# EAGLE design Mainboard (EAGLE 9.3.2)
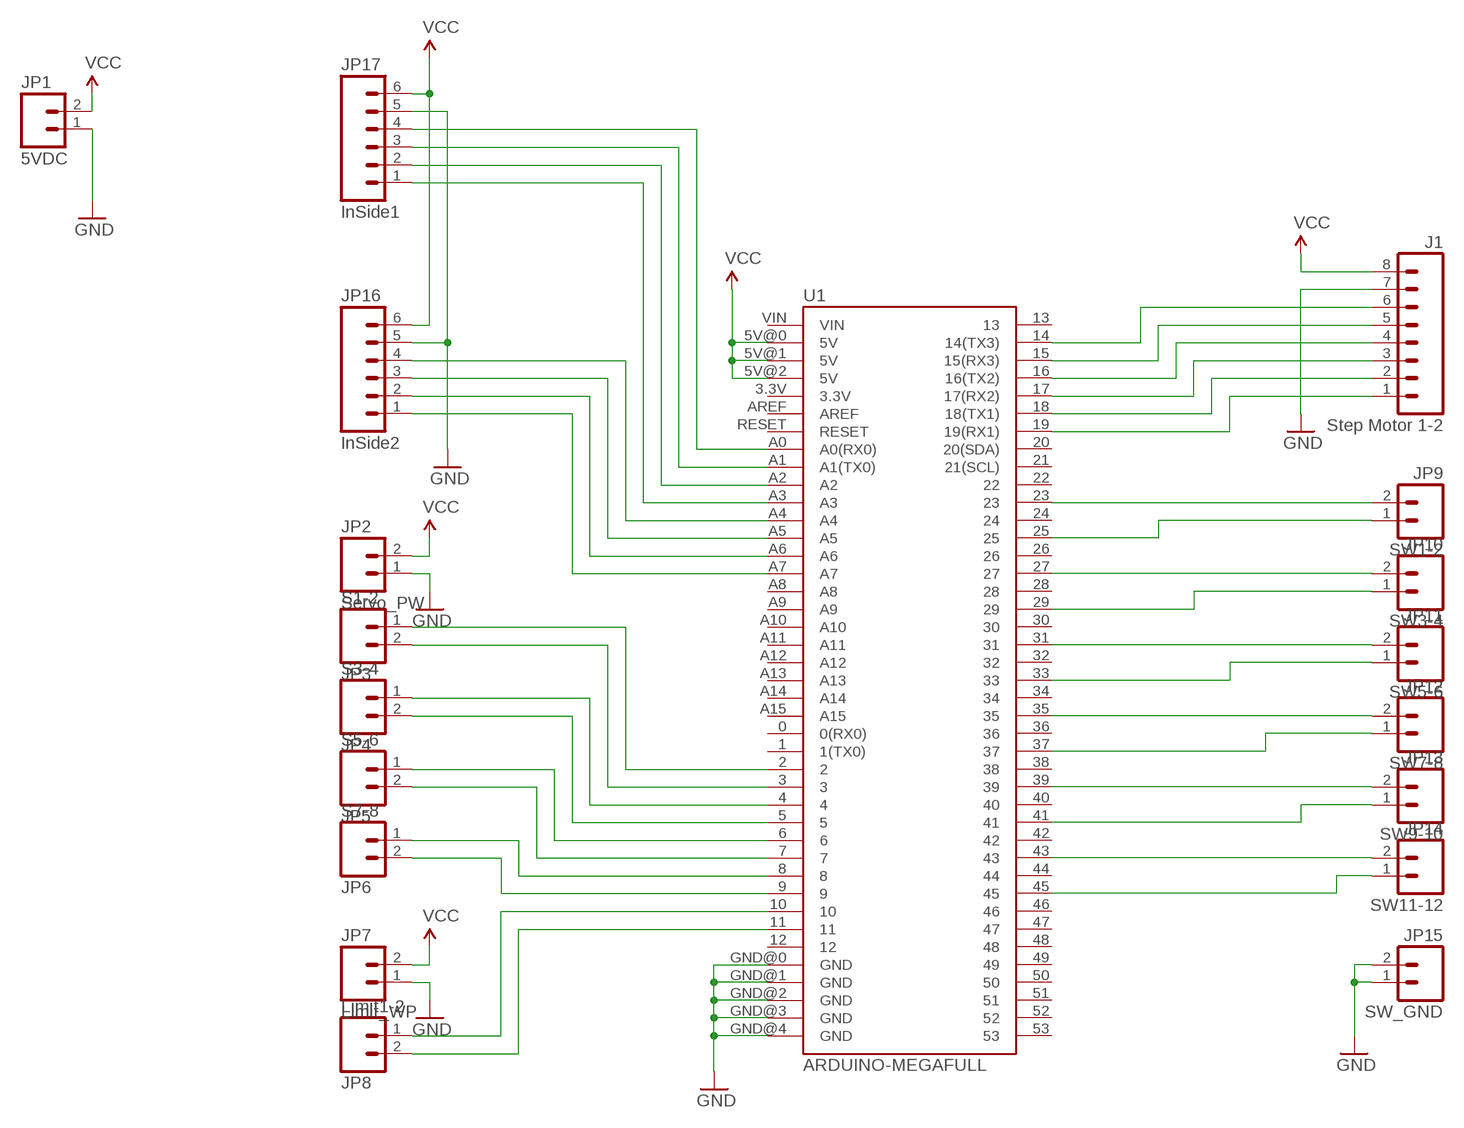
[diagram p0: schematic, sheet 1]

## Parts
J1  Step Motor 1-2  M08LONGPADS  [1X08_LONGPADS]
JP1  5VDC  M025MM  [SCREWTERMINAL-5MM-2]
JP2  Servo_PW  M025MM  [SCREWTERMINAL-5MM-2]
JP3  S1-2  M025MM  [SCREWTERMINAL-5MM-2]
JP4  S3-4  M025MM  [SCREWTERMINAL-5MM-2]
JP5  S5-6  M025MM  [SCREWTERMINAL-5MM-2]
JP6  S7-8  M025MM  [SCREWTERMINAL-5MM-2]
JP7  Limit_WP  M025MM  [SCREWTERMINAL-5MM-2]
JP8  Limit1-2  M025MM  [SCREWTERMINAL-5MM-2]
JP9  SW1-2  M025MM  [SCREWTERMINAL-5MM-2]
JP10  SW3-4  M025MM  [SCREWTERMINAL-5MM-2]
JP11  SW5-6  M025MM  [SCREWTERMINAL-5MM-2]
JP12  SW7-8  M025MM  [SCREWTERMINAL-5MM-2]
JP13  SW9-10  M025MM  [SCREWTERMINAL-5MM-2]
JP14  SW11-12  M025MM  [SCREWTERMINAL-5MM-2]
JP15  SW_GND  M025MM  [SCREWTERMINAL-5MM-2]
JP16  InSide2  M06LONGPADS  [1X06_LONGPADS]
JP17  InSide1  M06LONGPADS  [1X06_LONGPADS]
U1  ARDUINO-MEGAFULL  [ARDUINO_MEGA]

## Nets
GND: J1.7 JP1.1 JP2.1 JP7.1 JP15.1 JP15.2 JP16.5 JP17.5 U1.GND@0(GND) U1.GND@1(GND) U1.GND@2(GND) U1.GND@3(GND) U1.GND@4(GND)
N$3: JP3.1 U1.2
N$4: JP3.2 U1.3
N$5: JP4.1 U1.4
N$6: JP4.2 U1.5
N$7: JP5.1 U1.6
N$8: JP5.2 U1.7
N$9: JP6.1 U1.8
N$10: JP6.2 U1.9
N$11: JP8.1 U1.10
N$12: JP8.2 U1.11
N$13: JP9.2 U1.23
N$14: JP9.1 U1.25
N$15: JP10.2 U1.27
N$16: JP10.1 U1.29
N$17: JP11.2 U1.31
N$18: JP11.1 U1.33
N$19: JP12.2 U1.35
N$20: JP12.1 U1.37
N$21: JP13.2 U1.39
N$22: JP13.1 U1.41
N$23: JP14.2 U1.43
N$24: JP14.1 U1.45
N$25: JP17.4 U1.A0(A0(RX0))
N$26: JP17.3 U1.A1(A1(TX0))
N$27: JP17.2 U1.A2
N$28: JP17.1 U1.A3
N$29: JP16.4 U1.A4
N$30: JP16.3 U1.A5
N$31: JP16.2 U1.A6
N$32: JP16.1 U1.A7
N$33: J1.1 U1.19(19(RX1))
N$34: J1.2 U1.18(18(TX1))
N$35: J1.3 U1.17(17(RX2))
N$36: J1.4 U1.16(16(TX2))
N$37: J1.5 U1.15(15(RX3))
N$38: J1.6 U1.14(14(TX3))
VCC: J1.8 JP1.2 JP2.2 JP7.2 JP16.6 JP17.6 U1.5V@0(5V) U1.5V@1(5V) U1.5V@2(5V)
Unconnected: U1.0(0(RX0)) U1.1(1(TX0)) U1.3.3V U1.12 U1.13 U1.20(20(SDA)) U1.21(21(SCL)) U1.22 U1.24 U1.26 U1.28 U1.30 U1.32 U1.34 U1.36 U1.38 U1.40 U1.42 U1.44 U1.46 U1.47 U1.48 U1.49 U1.50 U1.51 U1.52 U1.53 U1.A8 U1.A9 U1.A10 U1.A11 U1.A12 U1.A13 U1.A14 U1.A15 U1.AREF U1.RESET U1.VIN

## Library data of the parts
J1 = SparkFun-Connectors:M08: Header 8 Standard 8-pin 0.1" header. Use with straight break away headers (SKU : PRT-00116), right angle break away headers (PRT-00553), swiss pins (PRT-00743), machine pins (PRT-00117), and female headers (PRT-00115).
JP1-JP15 = SparkFun:M02: Header 2 Standard 2-pin 0.1" header. Use with straight break away headers (SKU : PRT-00116), right angle break away headers (PRT-00553), swiss pins (PRT-00743), machine pins (PRT-00117), and female headers (PRT-00115). Molex polarized connector foot print use with SKU : PRT-08233 with associated crimp pins and housings.
JP16 JP17 = SparkFun:M06: Header 6 Standard 6-pin 0.1" header. Use with straight break away headers (SKU : PRT-00116), right angle break away headers (PRT-00553), swiss pins (PRT-00743), machine pins (PRT-00117), and female headers (PRT-00115). Molex polarized connector foot print use with SKU : PRT-08094 with associated crimp pins and housings. NOTES ON THE VARIANTS LOCK and LOCK_LONGPADS... This footprint was designed to help hold the alignment of a through-hole component (i.e. 6-pin header) while soldering it into place. You may notice that each hole has been shifted either up or down by 0.005 of an inch from it's more standard position (which is a perfectly straight line). This slight alteration caused the pins (the squares in the middle) to touch the edges of the holes. Because they are alternating, it causes a "brace" to hold the component in place. 0.005 has proven to be the perfect amount of "off-center" position when using our standard breakaway headers. Although looks a little odd when you look at the bare footprint, once you have a header in there, the alteration is very hard to notice. Also, if you push a header all the way into place, it is covered up entirely on the bottom side. This idea of altering the position of holes to aid alignment will be further integrated into the Sparkfun Library for other footprints. It can help hold any component with 3 or more connection pins.
U1 = SparkFun-Boards:ARDUINO-MEGA: Arduino Mega board footprint

## Board
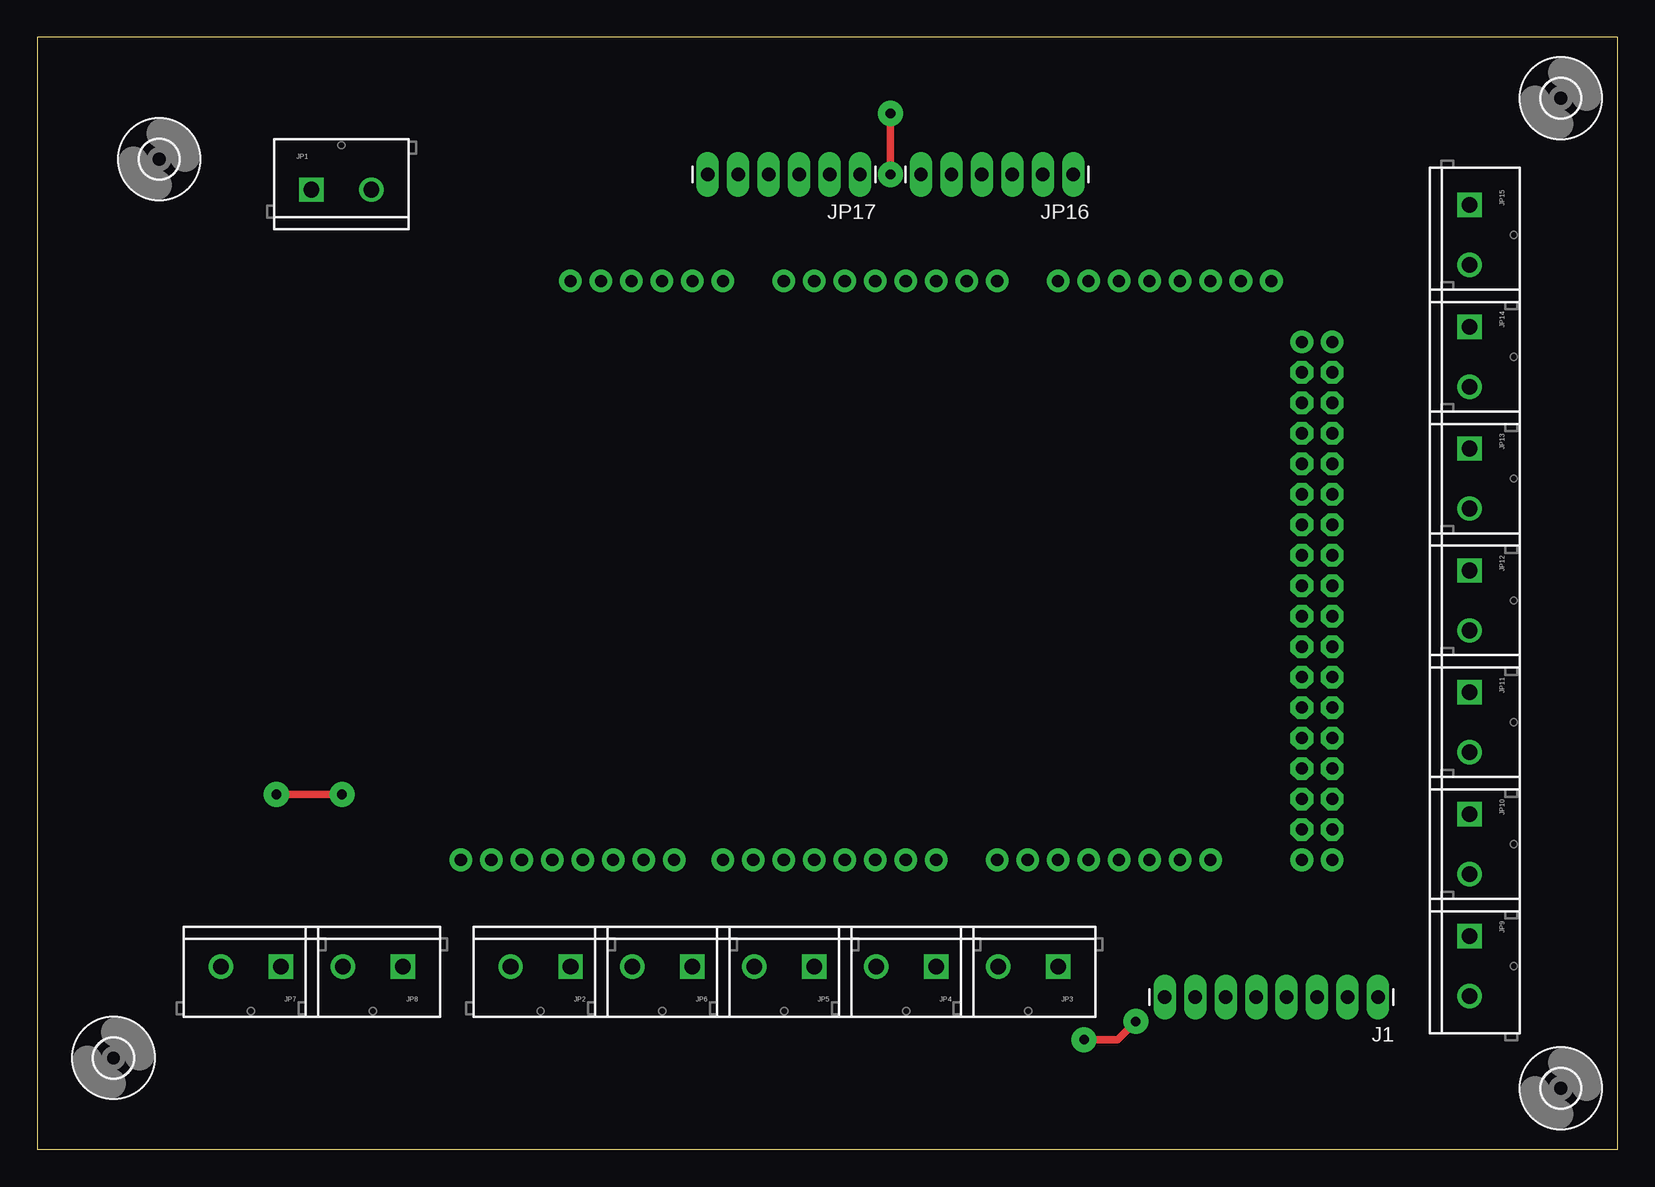
[diagram p1: board, top side]
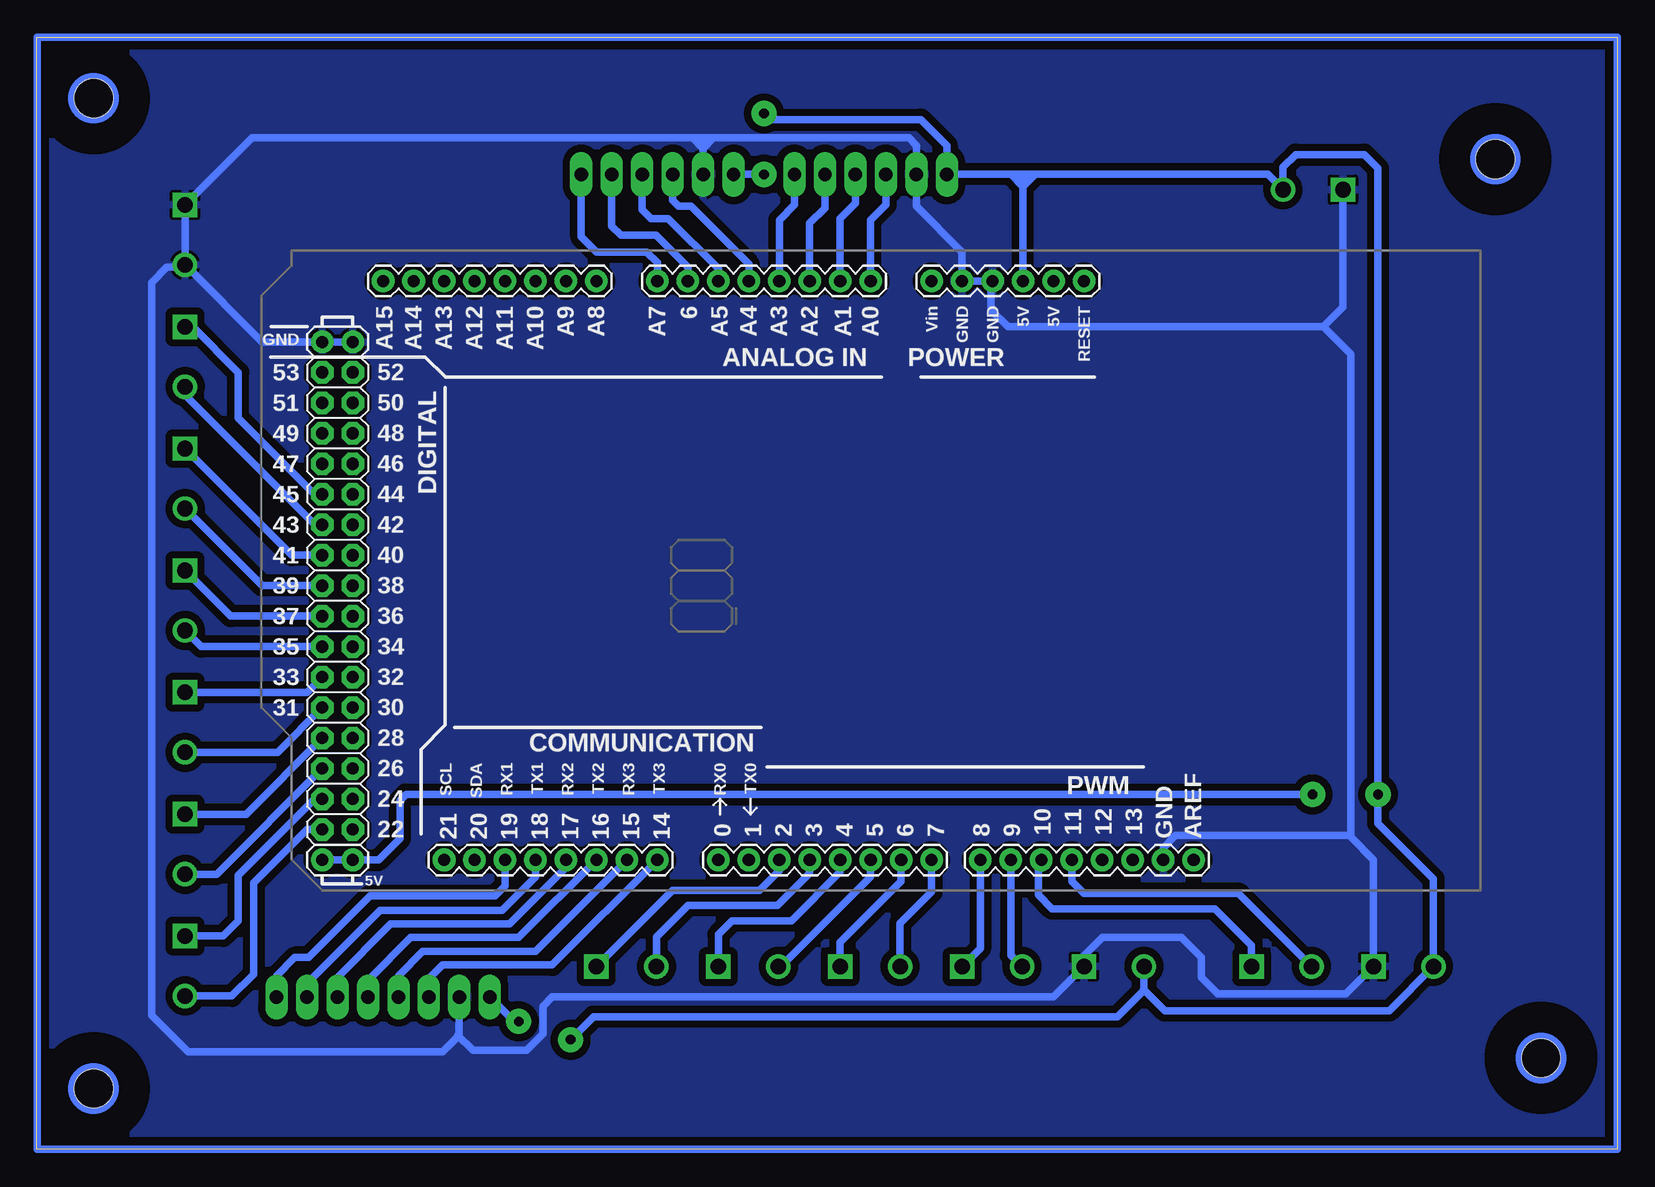
[diagram p2: board, bottom side, seen from below]

Size 131.75 x 92.7 mm. Coordinates in mm from the lower left corner, seen from the top.
Outline: 0,0 131.75,0 131.75,92.7 0,92.7 0,0
Copper layers (1*16): Top 0.035mm / dielectric 1.5mm / Bottom 0.035mm
Design rules "default": minimum track width 6mil, minimum drill 0.35mm, track to track 6mil, track to pad 6mil, pad to pad 6mil, via to via 6mil, smd to smd 6mil, copper to edge 40mil, drill to drill 6mil, minimum pad ring 10mil, minimum via ring 8mil, stop-mask expansion 4mil, vias tented up to drill 0mil, thermal gap 10mil

### Footprints (pad centres in the part's own frame; a part is rotated, then mirrored left to right if it is on the bottom)
1X08_LONGPADS = drill 1.118 pad 1.88 long: 1 0,0; 2 2.54,0; 3 5.08,0; 4 7.62,0; 5 10.16,0; 6 12.7,0; 7 15.24,0; 8 17.78,0
SCREWTERMINAL-5MM-2 = drill 1.3 pad 2.032 square: 1 0,0 | drill 1.3 pad 2.032: 2 5,0
1X06_LONGPADS = drill 1.118 pad 1.88 long: 1 0,0; 2 2.54,0; 3 5.08,0; 4 7.62,0; 5 10.16,0; 6 12.7,0
ARDUINO_MEGA = drill 1.016 pad 1.88: 0 63.5,50.8; 1 60.96,50.8; 2 58.42,50.8; 3 55.88,50.8; 3.3V 35.56,2.54; 4 53.34,50.8; 5 50.8,50.8; 5V@0 38.1,2.54; 5V@1 93.98,50.8; 5V@2 96.52,50.8; 6 48.26,50.8; 7 45.72,50.8; 8 41.656,50.8; 9 39.116,50.8; 10 36.576,50.8; 11 34.036,50.8; 12 31.496,50.8; 13 28.956,50.8; 14 68.58,50.8; 15 71.12,50.8; 16 73.66,50.8; 17 76.2,50.8; 18 78.74,50.8; 19 81.28,50.8; 20 83.82,50.8; 21 86.36,50.8; A0 50.8,2.54; A1 53.34,2.54; A2 55.88,2.54; A3 58.42,2.54; A4 60.96,2.54; A5 63.5,2.54; A6 66.04,2.54; A7 68.58,2.54; A8 73.66,2.54; A9 76.2,2.54; A10 78.74,2.54; A11 81.28,2.54; A12 83.82,2.54; A13 86.36,2.54; A14 88.9,2.54; A15 91.44,2.54; AREF 23.876,50.8; GND@0 40.64,2.54; GND@1 43.18,2.54; GND@2 93.98,7.62; GND@3 96.52,7.62; GND@4 26.416,50.8; RESET 33.02,2.54; VIN 45.72,2.54 | drill 1.016 pad 1.88 octagon: 22 93.98,48.26; 23 96.52,48.26; 24 93.98,45.72; 25 96.52,45.72; 26 93.98,43.18; 27 96.52,43.18; 28 93.98,40.64; 29 96.52,40.64; 30 93.98,38.1; 31 96.52,38.1; 32 93.98,35.56; 33 96.52,35.56; 34 93.98,33.02; 35 96.52,33.02; 36 93.98,30.48; 37 96.52,30.48; 38 93.98,27.94; 39 96.52,27.94; 40 93.98,25.4; 41 96.52,25.4; 42 93.98,22.86; 43 96.52,22.86; 44 93.98,20.32; 45 96.52,20.32; 46 93.98,17.78; 47 96.52,17.78; 48 93.98,15.24; 49 96.52,15.24; 50 93.98,12.7; 51 96.52,12.7; 52 93.98,10.16; 53 96.52,10.16
3,2 = hole 3.2: 0,0

### Placement (x,y rotation side)
J1  111.76,12.7 180 top
JP1  22.86,80.01 0 top
JP2  44.45,15.24 180 top
JP3  85.09,15.24 180 top
JP4  74.93,15.24 180 top
JP5  64.77,15.24 180 top
JP6  54.61,15.24 180 top
JP7  20.32,15.24 180 top
JP8  30.48,15.24 180 top
JP9  119.38,17.78 270 top
JP10  119.38,27.94 270 top
JP11  119.38,38.1 270 top
JP12  119.38,48.26 270 top
JP13  119.38,58.42 270 top
JP14  119.38,68.58 270 top
JP15  119.38,78.74 270 top
JP16  86.36,81.28 180 top
JP17  68.58,81.28 180 top
U1  11.43,74.93 180 bottom
U$1  [3,2]  6.35,7.62 0 top
U$2  [3,2]  127,5.08 0 top
U$3  [3,2]  127,87.63 0 top
U$4  [3,2]  10.16,82.55 0 top

### Tracks (layer width: path | path; a pad name or v marks a point on that pad's centre or on a via)
GND
  Bottom 0.61: U1.GND@2 U1.GND@3 112.95,67.31 JP15.2 | 96.52,9.65 96.65,9.53 95.38,8.26 90.93,8.26 89.53,9.65 89.53,11.94 88.77,12.7 46.99,12.7 JP2.1 44.45,16.13 42.93,17.65 36.32,17.65 34.67,16 34.67,14.35 33.27,12.95 22.61,12.95 JP7.1 20.32,24.13 22.23,26.04 | 96.52,9.65 J1.7 | 96.52,9.65 96.52,9.53 97.92,8.13 119.13,8.13 122.17,11.18 122.17,72.26 120.9,73.53 119.59,73.53 JP15.2 | JP15.2 JP15.1 113.79,84.33 77.09,84.33 | 77.09,84.33 59.05,84.33 58.42,83.69 JP17.5 58.42,78.61 54.61,74.8 U1.GND@1 U1.GND@0 52.2,72.26 52.2,69.98 50.8,68.58 24.51,68.58 | JP16.5 76.2,83.44 | 76.2,83.44 76.2,84.07 | JP1.1 22.86,70.23 24.51,68.58 | 75.18,84.33 75.31,84.33 76.2,83.44 | 77.09,84.33 76.2,83.44 | 22.23,26.04 22.35,26.16 36.83,26.16 37.85,25.15 U1.GND@4 | 22.23,26.04 22.23,66.29 24.51,68.58
  pour Bottom (isolate 0.61): 0,92.71 131.7,92.71 131.7,0 0,0
N$1
  Bottom 0.61: 0,92.71 131.7,92.71 131.7,0 0,0 0,92.71
N$3
  Bottom 0.61: U1.2 69.85,23.24 71.5,21.59 78.74,21.59 JP3.1
N$4
  Bottom 0.61: U1.3 67.31,22.99 69.98,20.32 77.47,20.32 80.09,17.7 JP3.2
N$5
  Bottom 0.61: U1.4 64.77,23.11 68.83,19.05 73.79,19.05 74.93,17.91 JP4.1
N$6
  Bottom 0.61: JP4.2 69.72,15.24 62.23,22.73 U1.5
N$7
  Bottom 0.61: U1.6 59.69,22.35 64.77,17.27 JP5.1
N$8
  Bottom 0.61: U1.7 57.15,21.46 59.77,18.84 JP5.2
N$9
  Bottom 0.61: U1.8 53.09,16.76 JP6.1
N$10
  Bottom 0.61: U1.9 50.55,16.18 JP6.2
N$11
  Bottom 0.61: JP8.1 30.48,17.02 33.53,20.07 47.12,20.07 48.26,21.21 48.26,23.88 U1.10
N$12
  Bottom 0.61: JP8.2 31.58,21.34 44.45,21.34 45.47,22.35 U1.11
N$13
  Bottom 0.61: U1.23 109.22,26.67 113.67,22.23 113.67,14.61 115.49,12.78 JP9.2
N$14
  Bottom 0.61: U1.25 108.58,29.21 114.94,22.86 114.94,19.05 116.2,17.78 JP9.1
N$15
  Bottom 0.61: U1.27 116.76,22.94 JP10.2
N$16
  Bottom 0.61: U1.29 114.3,27.94 JP10.1
N$17
  Bottom 0.61: U1.31 111.68,33.1 JP11.2
N$18
  Bottom 0.61: U1.33 109.22,38.1 JP11.1
N$19
  Bottom 0.61: U1.35 118.03,41.91 JP12.2
N$20
  Bottom 0.61: U1.37 115.57,44.45 JP12.1
N$21
  Bottom 0.61: U1.39 112.95,46.99 JP13.2
N$22
  Bottom 0.61: U1.41 110.49,49.53 JP13.1
N$23
  Bottom 0.61: U1.43 108.58,52.07 119.38,62.87 JP14.2
N$24
  Bottom 0.61: U1.45 108.58,54.61 114.94,60.96 114.94,64.77 118.75,68.58 JP14.1
N$25
  Bottom 0.61: U1.A0 62.23,77.47 60.96,78.74 JP17.4
N$26
  Bottom 0.61: U1.A1 64.77,77.6 63.5,78.87 JP17.3
N$27
  Bottom 0.61: U1.A2 67.31,77.22 66.04,78.49 JP17.2
N$28
  Bottom 0.61: U1.A3 69.85,77.47 68.58,78.74 JP17.1
N$29
  Bottom 0.61: U1.A4 72.39,73.79 77.22,78.61 78.23,78.61 78.74,79.12 JP16.4
N$30
  Bottom 0.61: U1.A5 74.93,73.41 79.12,77.6 80.52,77.6 81.28,78.36 JP16.3
N$31
  Bottom 0.61: U1.A6 77.47,73.53 80.14,76.2 83.06,76.2 83.82,76.96 JP16.2
N$32
  Bottom 0.61: U1.A7 80.01,73.91 80.9,74.8 85.09,74.8 86.36,76.07 JP16.1
N$33
  Bottom 0.61: U1.19 92.71,21.97 93.47,21.21 93.53,21.15 103.95,21.15 109.09,16 110.24,16 111.76,14.48 J1.1
N$34
  Bottom 0.61: U1.18 90.17,22.73 92.96,19.94 103.12,19.94 109.22,13.84 J1.2
N$35
  Bottom 0.61: U1.17 87.63,23.5 92.33,18.8 102.23,18.8 106.81,14.22 106.81,12.83 J1.3
N$36
  Bottom 0.61: U1.16 91.57,17.65 100.58,17.65 104.01,14.22 104.01,12.83 J1.4
N$37
  Bottom 0.61: U1.15 90.17,16.51 99.57,16.51 101.6,14.48 J1.5
N$38
  Bottom 0.61: U1.14 88.77,15.37 97.92,15.37 99.06,14.22 J1.6
VCC  (via drill 0.8 pad 2.1)
  Top 0.61: v71.12,81.28 v71.12,86.36 | v87.25,9.14 90.04,9.14 v91.57,10.67 | v25.4,29.59 v19.94,29.59
  Bottom 0.61: U1.5V@2 U1.5V@1 103.25,24.13 101.47,25.91 101.47,29.08 100.97,29.59 v25.4,29.59 | 48.51,81.28 29.13,81.28 JP1.2 27.86,81.87 26.8,82.93 21.08,82.93 19.94,81.79 v19.94,29.59 19.94,27.18 15.32,22.56 JP7.2 19,11.56 37.72,11.56 39.5,13.34 39.45,13.38 JP2.2 39.45,13.26 41.66,11.05 85.34,11.05 v87.25,9.14 | 48.51,81.28 49.4,81.28 | 49.4,81.28 50.55,81.28 | 50.55,81.28 JP17.6 55.88,83.69 58.04,85.85 70.61,85.85 v71.12,86.36 | U1.5V@0 49.53,80.26 | 49.53,80.26 49.53,81.15 49.4,81.28 | 49.53,80.26 48.51,81.28 | 49.53,80.26 50.55,81.28 | JP16.6 v71.12,81.28 | v91.57,10.67 91.95,10.67 J1.8
(copper drawn outside any net)
  shapes: Bottom circle x4